# EasyEDA schematic SCH_graduation_atmega_2023-07-09.json
TITLE: Sheet_1; REV: 1.0; Date: 2023-07-06; Sheet: 1/1; Drawn By: mohamednemr000; Company: Your Company
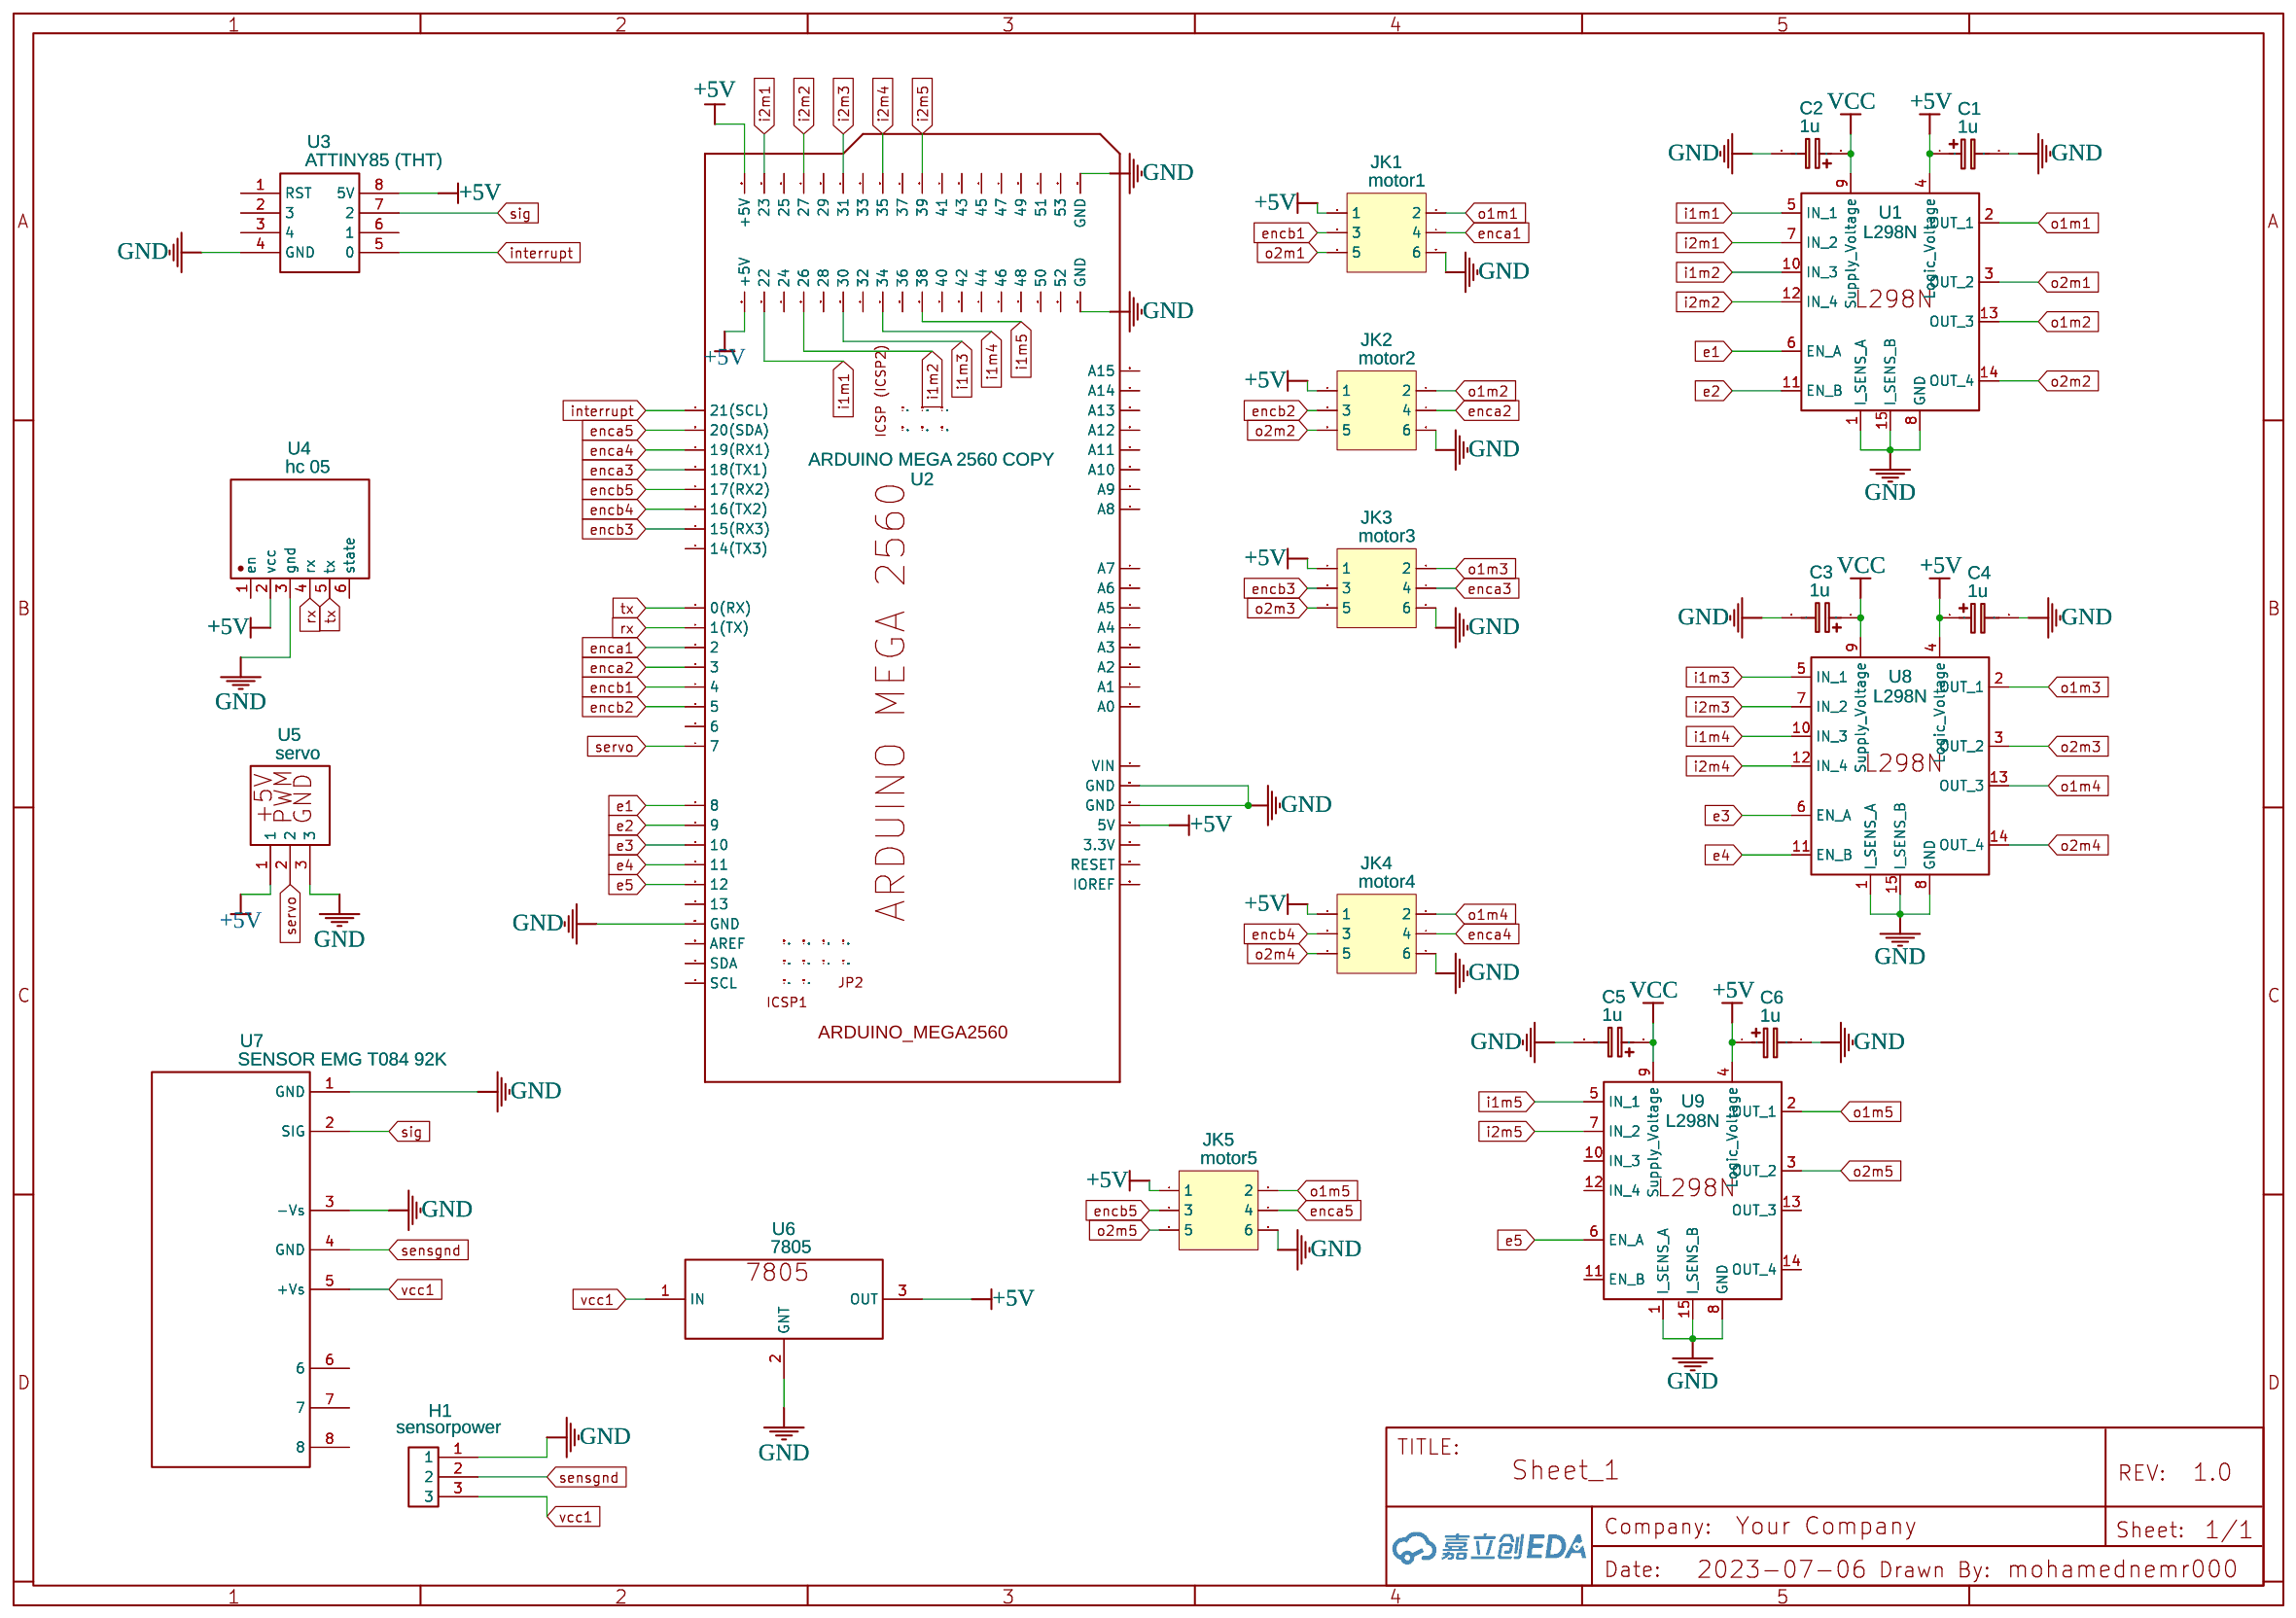
[diagram p0: schematic sheet]

## Parts
C1  1u  [CAP-D3.0×F1.5]
C2  1u  [CAP-D3.0×F1.5]
C3  1u  [CAP-D3.0×F1.5]
C4  1u  [CAP-D3.0×F1.5]
C5  1u  [CAP-D3.0×F1.5]
C6  1u  [CAP-D3.0×F1.5]
H1  sensorpower  [HEADER_3*1]
JK1  motor1  [SIP3*2]
JK2  motor2  [SIP3*2]
JK3  motor3  [SIP3*2]
JK4  motor4  [SIP3*2]
JK5  motor5  [SIP3*2]
U1  L298N  [L298N]
U2  ARDUINO MEGA 2560 COPY  [ADUINO MEGA 2560 COPY]
U3  ATTINY85 (THT)  [ATTINY85]
U4  hc 05  [HC05]
U5  servo  [SERVO]
U6  7805  [7805]
U7  SENSOR EMG T084 92K  [SENSOR EMG T084 92K]
U8  L298N  [L298N]
U9  L298N  [L298N]

## Library data of the parts
C1-C6 = CE_TH_D3.0×F1.5_EU: Contributor: LCEDA_Lib
H1 = Header_3*1: Contributor: harkhka
JK1-JK5 = CON3*2: Contributor: Ksh7
U1 U8 U9 = L298N: Contributor: HaiderA.Noori
U2 = ARDUINO MEGA 2560 COPY: Contributor: giedresim
U3 = ATTINY85 (THT): Manufacturer Part: ATTINY85-20PU; Supplier Part: 1455162; Supplier: Element14; link: http://au.element14.com/atmel/attiny85-20pu/mcu-8bit-attiny-20mhz-dip-8/dp/1455162; Contributor: AutogolazzoJr
U4 = hc 05: Contributor: bagussusilo646
U5 = servo: Contributor: hintz_
U6 = 7805: Contributor: 51450
U7 = SENSOR EMG T084 92K: Contributor: maikodesousa

## Nets
+5V: C1.1 C4.1 C6.1 JK1.1 JK2.1 JK3.1 JK4.1 JK5.1 U1.4(Logic Voltage) U2.5V_1(+5V) U2.5V_2(+5V) U2.5V_3(5V) U3.8(5V) U4.2(vcc) U5.1 U6.3(OUT) U8.4(Logic Voltage) U9.4(Logic Voltage)
GND: C1.2 C2.2 C3.2 C4.2 C5.2 C6.2 H1.1 JK1.6 JK2.6 JK3.6 JK4.6 JK5.6 U1.1(I SENS A) U1.8(GND) U1.15(I SENS B) U2.GND_1(GND) U2.GND_2(GND) U2.GND_3(GND) U2.GND_4(GND) U2.GND_5(GND) U3.4(GND) U4.3(gnd) U5.3 U6.2(GNT) U7.1(GND) U7.3(-Vs) U8.1(I SENS A) U8.8(GND) U8.15(I SENS B) U9.1(I SENS A) U9.8(GND) U9.15(I SENS B)
VCC: C2.1 C3.1 C5.1 U1.9(Supply Voltage) U8.9(Supply Voltage) U9.9(Supply Voltage)
vcc1: H1.3 U6.1(IN) U7.5(+Vs)
e1: U1.6(EN A) U2.8
e2: U1.11(EN B) U2.9
e3: U2.10 U8.6(EN A)
e4: U2.11 U8.11(EN B)
e5: U2.12 U9.6(EN A)
enca1: JK1.4 U2.2
enca2: JK2.4 U2.3
enca3: JK3.4 U2.18(18(TX1))
enca4: JK4.4 U2.19(19(RX1))
enca5: JK5.4 U2.20(20(SDA))
encb1: JK1.3 U2.4
encb2: JK2.3 U2.5
encb3: JK3.3 U2.15(15(RX3))
encb4: JK4.3 U2.16(16(TX2))
encb5: JK5.3 U2.17(17(RX2))
i1m1: U1.5(IN 1) U2.22
i1m2: U1.10(IN 3) U2.26
i1m3: U2.30 U8.5(IN 1)
i1m4: U2.34 U8.10(IN 3)
i1m5: U2.38 U9.5(IN 1)
i2m1: U1.7(IN 2) U2.23
i2m2: U1.12(IN 4) U2.27
i2m3: U2.31 U8.7(IN 2)
i2m4: U2.35 U8.12(IN 4)
i2m5: U2.39 U9.7(IN 2)
interrupt: U2.21(21(SCL)) U3.5(0)
o1m1: JK1.2 U1.2(OUT 1)
o1m2: JK2.2 U1.13(OUT 3)
o1m3: JK3.2 U8.2(OUT 1)
o1m4: JK4.2 U8.13(OUT 3)
o1m5: JK5.2 U9.2(OUT 1)
o2m1: JK1.5 U1.3(OUT 2)
o2m2: JK2.5 U1.14(OUT 4)
o2m3: JK3.5 U8.3(OUT 2)
o2m4: JK4.5 U8.14(OUT 4)
o2m5: JK5.5 U9.3(OUT 2)
rx: U2.1(1(TX)) U4.4(rx)
sensgnd: H1.2 U7.4(GND)
servo: U2.7 U5.2
sig: U3.7(2) U7.2(SIG)
tx: U2.0(0(RX)) U4.5(tx)

Not connected (* = marked no-connect by the designer): U2 3V3(3.3V) 6 13 14(14(TX3)) 24 25 28 29 32 33 36 37 40 41 42 43 44 45 46 47 48 49 50 51 52 53 A0 A1 A2 A3 A4 A5 A6 A7 A8 A9 A10 A11 A12 A13 A14 A15 AREF ICSP1_1(GND_) ICSP1_2(RESET_) ICSP1_3(MOSI) ICSP1_4(SCK) ICSP1_5(+5V_) ICSP1_6(MISO) ICSP2_1(MISO) ICSP2_2(+5V_) ICSP2_3(SCK) ICSP2_4(MOSI) ICSP2_5(RESET_) ICSP2_6(GND_) IOREF JP2_1(GND_) JP2_2(RESET_) JP2_3(MOSI) JP2_4(SCK) RESET SCL SDA VIN; U3 1(RST) 2(3) 3(4) 6(1); U4 1(en) 6(state); U7 6 7 8; U9 10(IN 3) 11(EN B) 12(IN 4) 13(OUT 3) 14(OUT 4)
